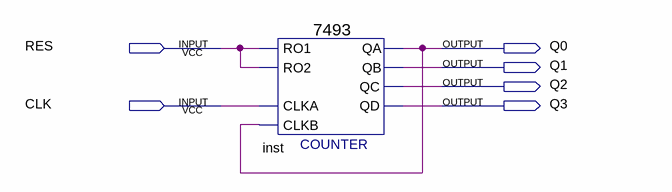
[diagram p0: schematic sheet]
// Quartus schematic top7493.bdf as structural Verilog: 1 symbols, 6 pins
module top7493 (
  input  RES,
  input  CLK,
  output Q0,
  output Q1,
  output Q2,
  output Q3
);

  \7493  inst (.RO1(RES), .RO2(RES), .CLKA(CLK), .CLKB(Q0), .QC(Q2), .QB(Q1), .QA(Q0), .QD(Q3));
endmodule
